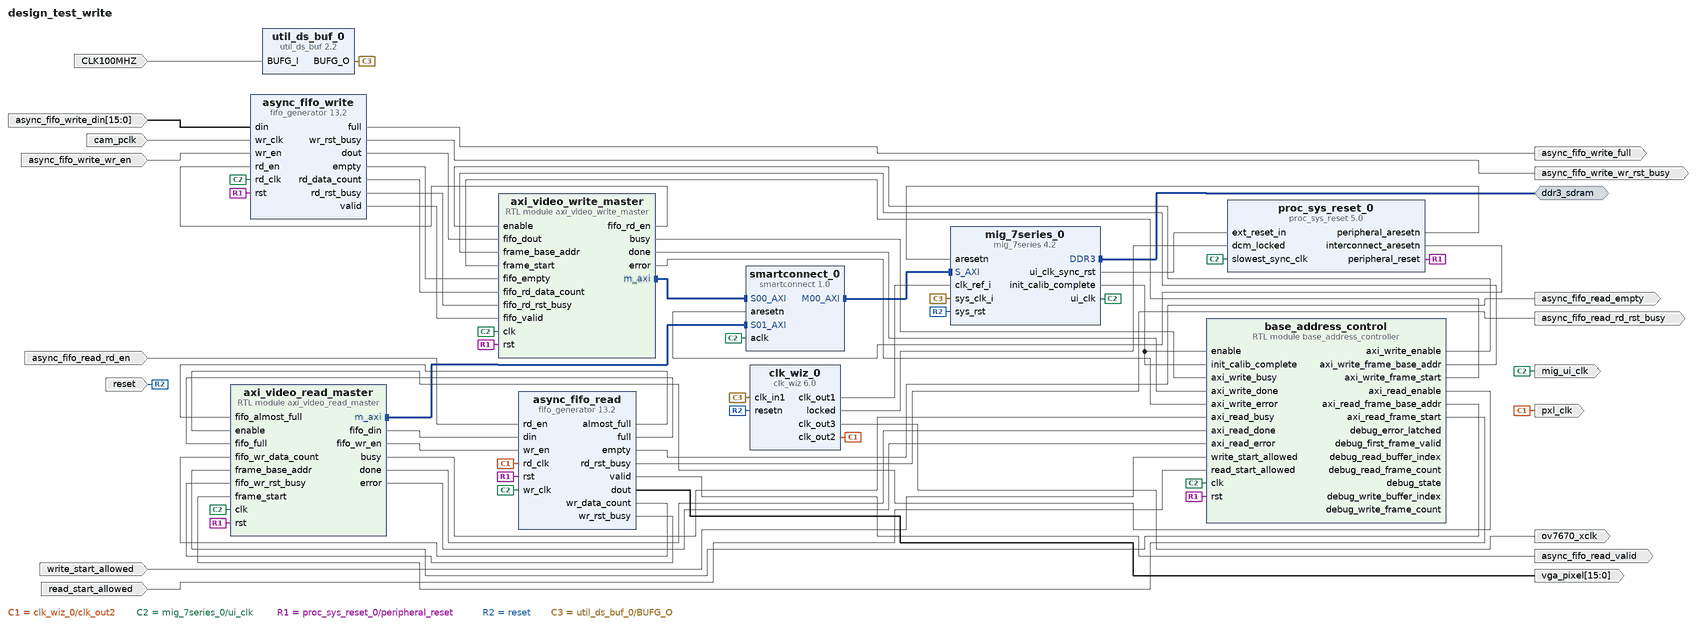
[diagram p0: block diagram of the top level]
# Vivado block design design_test_write, xc7a100tcsg324-1, Vivado 2025.2
create_bd_design design_test_write

create_bd_intf_port -mode Master -vlnv xilinx.com:interface:ddrx_rtl:1.0 ddr3_sdram
create_bd_port -dir I -type rst reset
create_bd_port -dir I -type clk CLK100MHZ
set_property -dict {CONFIG.FREQ_HZ 100000000} [get_bd_ports CLK100MHZ]
create_bd_port -dir O -from 15 -to 0 -type data vga_pixel
create_bd_port -dir O -type clk pxl_clk
create_bd_port -dir O -type data async_fifo_read_empty
create_bd_port -dir O async_fifo_read_valid
create_bd_port -dir O async_fifo_read_rd_rst_busy
create_bd_port -dir O async_fifo_write_full
create_bd_port -dir O async_fifo_write_wr_rst_busy
create_bd_port -dir O -type clk ov7670_xclk
create_bd_port -dir O -type clk mig_ui_clk
create_bd_port -dir I -type data async_fifo_read_rd_en
create_bd_port -dir I -from 15 -to 0 async_fifo_write_din
create_bd_port -dir I async_fifo_write_wr_en
create_bd_port -dir I -type clk cam_pclk
set_property -dict {CONFIG.FREQ_HZ 25000000} [get_bd_ports cam_pclk]
create_bd_port -dir I -type data write_start_allowed
create_bd_port -dir I -type data read_start_allowed

create_bd_cell -type ip -vlnv xilinx.com:ip:mig_7series:4.2 mig_7series_0
set_property -dict [list \
  CONFIG.BOARD_MIG_PARAM ddr3_sdram \
  CONFIG.MIG_DONT_TOUCH_PARAM Custom \
  CONFIG.RESET_BOARD_INTERFACE Custom \
  CONFIG.XML_INPUT_FILE mig_b.prj \
] [get_bd_cells mig_7series_0]
create_bd_cell -type ip -vlnv xilinx.com:ip:clk_wiz:6.0 clk_wiz_0
set_property -dict [list \
  CONFIG.CLKOUT1_JITTER 114.829 \
  CONFIG.CLKOUT1_REQUESTED_OUT_FREQ 200.000 \
  CONFIG.CLKOUT2_DRIVES BUFG \
  CONFIG.CLKOUT2_JITTER 175.402 \
  CONFIG.CLKOUT2_PHASE_ERROR 98.575 \
  CONFIG.CLKOUT2_REQUESTED_OUT_FREQ 25.000 \
  CONFIG.CLKOUT2_USED true \
  CONFIG.CLKOUT3_JITTER 175.402 \
  CONFIG.CLKOUT3_PHASE_ERROR 98.575 \
  CONFIG.CLKOUT3_REQUESTED_OUT_FREQ 25.000 \
  CONFIG.CLKOUT3_USED true \
  CONFIG.MMCM_CLKOUT0_DIVIDE_F 5.000 \
  CONFIG.MMCM_CLKOUT1_DIVIDE 40 \
  CONFIG.MMCM_CLKOUT2_DIVIDE 40 \
  CONFIG.NUM_OUT_CLKS 3 \
  CONFIG.PRIM_SOURCE No_buffer \
  CONFIG.RESET_PORT resetn \
  CONFIG.RESET_TYPE ACTIVE_LOW \
] [get_bd_cells clk_wiz_0]
create_bd_cell -type ip -vlnv xilinx.com:ip:util_ds_buf:2.2 util_ds_buf_0
set_property -dict {CONFIG.C_BUF_TYPE BUFG} [get_bd_cells util_ds_buf_0]
create_bd_cell -type ip -vlnv xilinx.com:ip:proc_sys_reset:5.0 proc_sys_reset_0
create_bd_cell -type ip -vlnv xilinx.com:ip:smartconnect:1.0 smartconnect_0
set_property -dict {CONFIG.NUM_SI 2} [get_bd_cells smartconnect_0]
create_bd_cell -type module -reference base_address_controller base_address_control
create_bd_cell -type ip -vlnv xilinx.com:ip:fifo_generator:13.2 async_fifo_write
set_property -dict [list \
  CONFIG.Almost_Empty_Flag true \
  CONFIG.Almost_Full_Flag true \
  CONFIG.Fifo_Implementation Independent_Clocks_Block_RAM \
  CONFIG.Input_Data_Width 16 \
  CONFIG.Input_Depth 2048 \
  CONFIG.Overflow_Flag true \
  CONFIG.Performance_Options First_Word_Fall_Through \
  CONFIG.Read_Data_Count true \
  CONFIG.Underflow_Flag true \
  CONFIG.Use_Extra_Logic true \
  CONFIG.Valid_Flag true \
  CONFIG.Write_Data_Count true \
] [get_bd_cells async_fifo_write]
create_bd_cell -type ip -vlnv xilinx.com:ip:fifo_generator:13.2 async_fifo_read
set_property -dict [list \
  CONFIG.Almost_Empty_Flag true \
  CONFIG.Almost_Full_Flag true \
  CONFIG.Fifo_Implementation Independent_Clocks_Block_RAM \
  CONFIG.Input_Data_Width 16 \
  CONFIG.Overflow_Flag true \
  CONFIG.Performance_Options First_Word_Fall_Through \
  CONFIG.Read_Data_Count true \
  CONFIG.Underflow_Flag true \
  CONFIG.Valid_Flag true \
  CONFIG.Write_Data_Count true \
] [get_bd_cells async_fifo_read]
create_bd_cell -type module -reference axi_video_write_master axi_video_write_master
set_property -dict {CONFIG.BURST_LEN 8 CONFIG.FIFO_COUNT_WIDTH 12} [get_bd_cells axi_video_write_master]
create_bd_cell -type module -reference axi_video_read_master axi_video_read_master
set_property -dict {CONFIG.BURST_LEN 8} [get_bd_cells axi_video_read_master]

# ---- connections ----

connect_bd_intf_net [get_bd_intf_pins axi_video_read_master/m_axi] [get_bd_intf_pins smartconnect_0/S01_AXI]
connect_bd_intf_net [get_bd_intf_pins axi_video_write_master/m_axi] [get_bd_intf_pins smartconnect_0/S00_AXI]
connect_bd_intf_net [get_bd_intf_ports ddr3_sdram] [get_bd_intf_pins mig_7series_0/DDR3]
connect_bd_intf_net [get_bd_intf_pins smartconnect_0/M00_AXI] [get_bd_intf_pins mig_7series_0/S_AXI]
connect_bd_net [get_bd_ports CLK100MHZ] [get_bd_pins util_ds_buf_0/BUFG_I]
connect_bd_net [get_bd_pins async_fifo_read/almost_full] [get_bd_pins axi_video_read_master/fifo_almost_full]
connect_bd_net [get_bd_pins async_fifo_read/empty] [get_bd_ports async_fifo_read_empty]
connect_bd_net [get_bd_pins async_fifo_read/full] [get_bd_pins axi_video_read_master/fifo_full]
connect_bd_net [get_bd_ports async_fifo_read_rd_en] [get_bd_pins async_fifo_read/rd_en]
connect_bd_net [get_bd_pins async_fifo_read/rd_rst_busy] [get_bd_ports async_fifo_read_rd_rst_busy]
connect_bd_net [get_bd_pins async_fifo_read/valid] [get_bd_ports async_fifo_read_valid]
connect_bd_net [get_bd_pins async_fifo_read/wr_data_count] [get_bd_pins axi_video_read_master/fifo_wr_data_count]
connect_bd_net [get_bd_pins async_fifo_read/wr_rst_busy] [get_bd_pins axi_video_read_master/fifo_wr_rst_busy]
connect_bd_net [get_bd_pins async_fifo_write/dout] [get_bd_pins axi_video_write_master/fifo_dout]
connect_bd_net [get_bd_pins async_fifo_write/empty] [get_bd_pins axi_video_write_master/fifo_empty]
connect_bd_net [get_bd_pins async_fifo_write/full] [get_bd_ports async_fifo_write_full]
connect_bd_net [get_bd_pins async_fifo_write/rd_data_count] [get_bd_pins axi_video_write_master/fifo_rd_data_count]
connect_bd_net [get_bd_pins async_fifo_write/rd_rst_busy] [get_bd_pins axi_video_write_master/fifo_rd_rst_busy]
connect_bd_net [get_bd_pins async_fifo_write/valid] [get_bd_pins axi_video_write_master/fifo_valid]
connect_bd_net [get_bd_pins async_fifo_write/wr_rst_busy] [get_bd_ports async_fifo_write_wr_rst_busy]
connect_bd_net [get_bd_pins axi_video_read_master/busy] [get_bd_pins base_address_control/axi_read_busy]
connect_bd_net [get_bd_pins axi_video_read_master/done] [get_bd_pins base_address_control/axi_read_done]
connect_bd_net [get_bd_pins axi_video_read_master/error] [get_bd_pins base_address_control/axi_read_error]
connect_bd_net [get_bd_pins axi_video_read_master/fifo_din] [get_bd_pins async_fifo_read/din]
connect_bd_net [get_bd_pins axi_video_read_master/fifo_wr_en] [get_bd_pins async_fifo_read/wr_en]
connect_bd_net [get_bd_pins axi_video_write_master/busy] [get_bd_pins base_address_control/axi_write_busy]
connect_bd_net [get_bd_pins axi_video_write_master/done] [get_bd_pins base_address_control/axi_write_done]
connect_bd_net [get_bd_pins axi_video_write_master/error] [get_bd_pins base_address_control/axi_write_error]
connect_bd_net [get_bd_pins axi_video_write_master/fifo_rd_en] [get_bd_pins async_fifo_write/rd_en]
connect_bd_net -net base_address_control_0_axi_read_enable [get_bd_pins base_address_control/axi_read_enable] \
  [get_bd_pins axi_video_read_master/enable]
connect_bd_net -net base_address_control_0_axi_read_frame_base_addr [get_bd_pins base_address_control/axi_read_frame_base_addr] \
  [get_bd_pins axi_video_read_master/frame_base_addr]
connect_bd_net -net base_address_control_0_axi_read_frame_start [get_bd_pins base_address_control/axi_read_frame_start] \
  [get_bd_pins axi_video_read_master/frame_start]
connect_bd_net -net base_address_control_0_axi_write_enable [get_bd_pins base_address_control/axi_write_enable] \
  [get_bd_pins axi_video_write_master/enable]
connect_bd_net -net base_address_control_0_axi_write_frame_base_addr [get_bd_pins base_address_control/axi_write_frame_base_addr] \
  [get_bd_pins axi_video_write_master/frame_base_addr]
connect_bd_net -net base_address_control_0_axi_write_frame_start [get_bd_pins base_address_control/axi_write_frame_start] \
  [get_bd_pins axi_video_write_master/frame_start]
connect_bd_net [get_bd_pins clk_wiz_0/clk_out1] [get_bd_pins mig_7series_0/clk_ref_i]
connect_bd_net [get_bd_pins clk_wiz_0/clk_out2] [get_bd_pins async_fifo_read/rd_clk] [get_bd_ports pxl_clk]
connect_bd_net [get_bd_pins clk_wiz_0/clk_out3] [get_bd_ports ov7670_xclk]
connect_bd_net [get_bd_pins clk_wiz_0/locked] [get_bd_pins proc_sys_reset_0/dcm_locked]
# net debug_error_latched has one end: base_address_control/debug_error_latched
# net debug_first_frame_valid has one end: base_address_control/debug_first_frame_valid
# net debug_read_buffer_index has one end: base_address_control/debug_read_buffer_index
# net debug_read_frame_count has one end: base_address_control/debug_read_frame_count
# net debug_state_2 has one end: base_address_control/debug_state
# net debug_write_buffer_index has one end: base_address_control/debug_write_buffer_index
# net debug_write_frame_count has one end: base_address_control/debug_write_frame_count
connect_bd_net -net din_0_1 [get_bd_ports async_fifo_write_din] [get_bd_pins async_fifo_write/din]
connect_bd_net -net dout [get_bd_pins async_fifo_read/dout] [get_bd_ports vga_pixel]
connect_bd_net [get_bd_pins mig_7series_0/init_calib_complete] \
  [get_bd_pins base_address_control/enable] [get_bd_pins base_address_control/init_calib_complete]
connect_bd_net [get_bd_pins mig_7series_0/ui_clk] \
  [get_bd_pins proc_sys_reset_0/slowest_sync_clk] [get_bd_pins smartconnect_0/aclk] [get_bd_pins async_fifo_read/wr_clk] \
  [get_bd_pins async_fifo_write/rd_clk] [get_bd_ports mig_ui_clk] [get_bd_pins axi_video_read_master/clk] \
  [get_bd_pins axi_video_write_master/clk] [get_bd_pins base_address_control/clk]
connect_bd_net [get_bd_pins mig_7series_0/ui_clk_sync_rst] [get_bd_pins proc_sys_reset_0/ext_reset_in]
connect_bd_net [get_bd_pins proc_sys_reset_0/interconnect_aresetn] [get_bd_pins smartconnect_0/aresetn]
connect_bd_net [get_bd_pins proc_sys_reset_0/peripheral_aresetn] [get_bd_pins mig_7series_0/aresetn]
connect_bd_net [get_bd_pins proc_sys_reset_0/peripheral_reset] \
  [get_bd_pins async_fifo_read/rst] [get_bd_pins async_fifo_write/rst] [get_bd_pins axi_video_read_master/rst] \
  [get_bd_pins axi_video_write_master/rst] [get_bd_pins base_address_control/rst]
connect_bd_net [get_bd_ports reset] [get_bd_pins clk_wiz_0/resetn] [get_bd_pins mig_7series_0/sys_rst]
connect_bd_net -net sw0_1 [get_bd_ports write_start_allowed] [get_bd_pins base_address_control/write_start_allowed]
connect_bd_net -net sw1_1 [get_bd_ports read_start_allowed] [get_bd_pins base_address_control/read_start_allowed]
connect_bd_net [get_bd_pins util_ds_buf_0/BUFG_O] [get_bd_pins clk_wiz_0/clk_in1] [get_bd_pins mig_7series_0/sys_clk_i]
connect_bd_net -net wr_clk_0_1 [get_bd_ports cam_pclk] [get_bd_pins async_fifo_write/wr_clk]
connect_bd_net -net wr_en_0_1 [get_bd_ports async_fifo_write_wr_en] [get_bd_pins async_fifo_write/wr_en]

# ---- address map ----
assign_bd_address -offset 0x80000000 -range 256M -target_address_space [get_bd_addr_spaces axi_video_read_master/m_axi] [get_bd_addr_segs mig_7series_0/memmap/memaddr]
assign_bd_address -offset 0x80000000 -range 256M -target_address_space [get_bd_addr_spaces axi_video_write_master/m_axi] [get_bd_addr_segs mig_7series_0/memmap/memaddr]

validate_bd_design
save_bd_design
